# Altium project WT-32 V3.2.PrjPcb (part 3 of 4)

## Sheet Controller_Sheet.SchDoc: Controller
size 420 x 297 mm; Engineer: Zain Siddiqui; Revision: V3.2
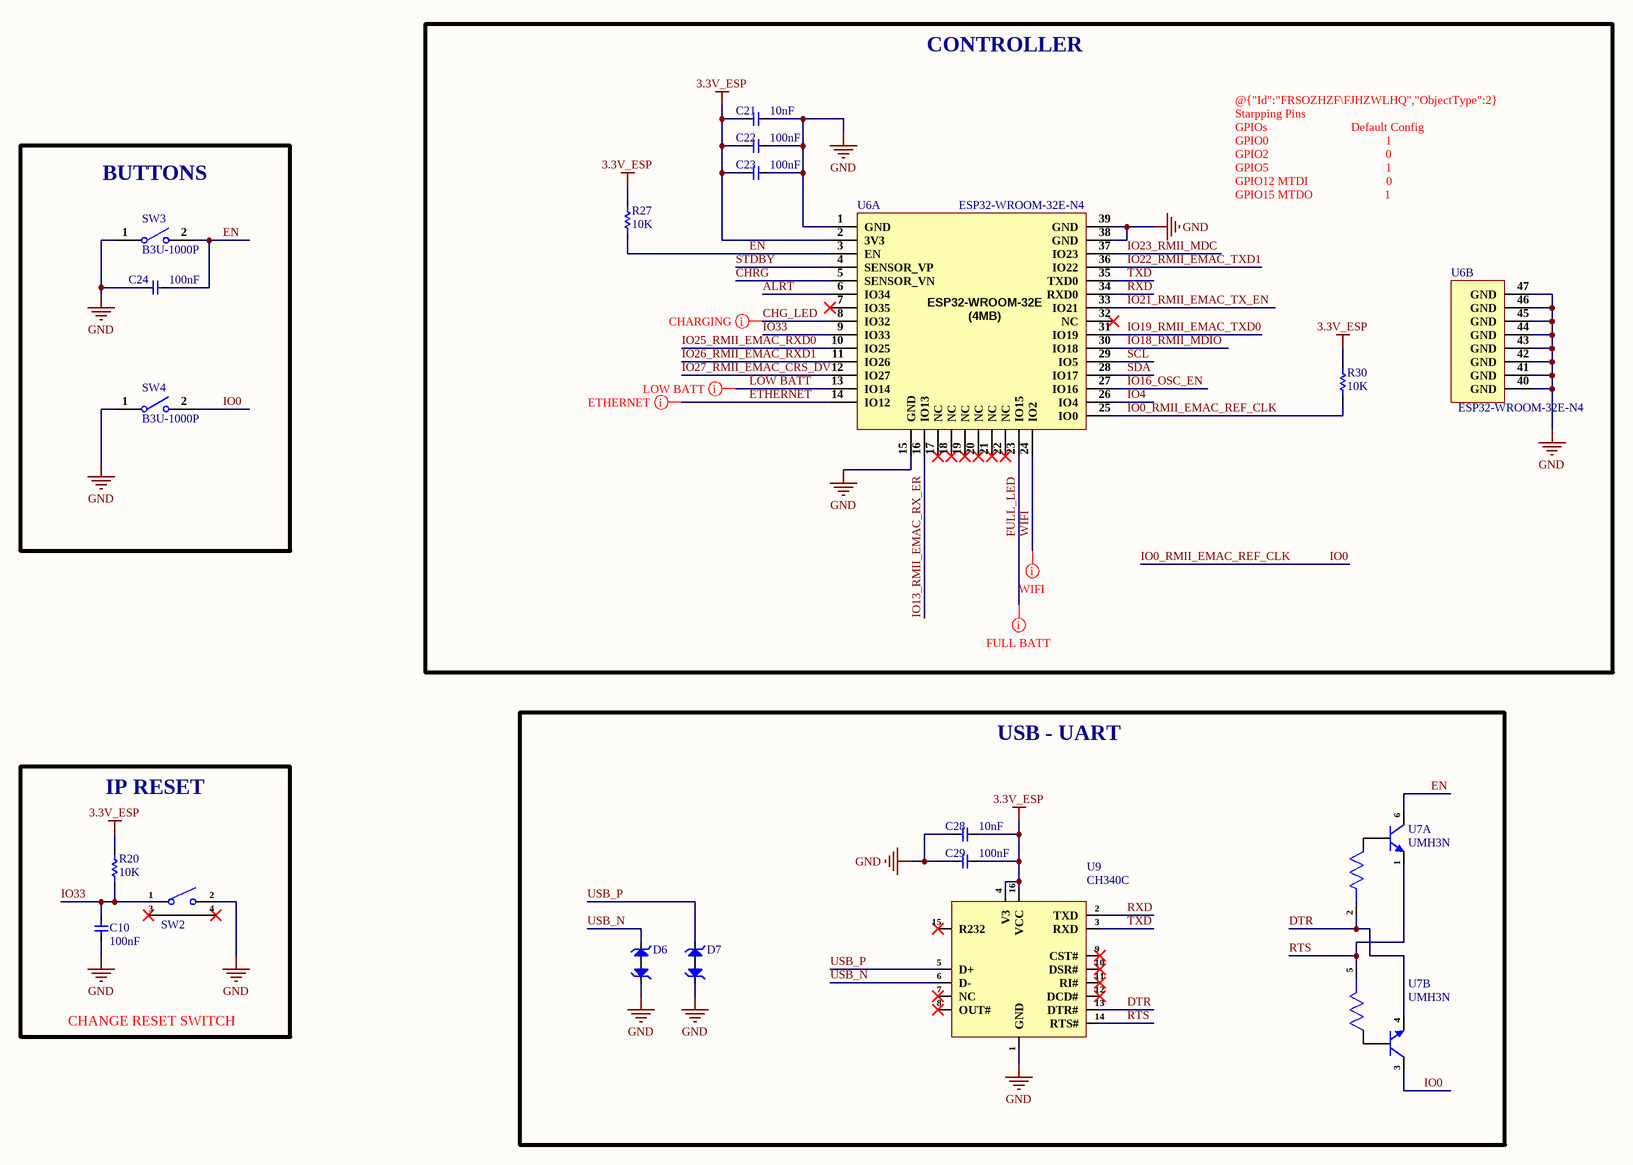
[diagram p1: Controller_Sheet.SchDoc]

### Parts
C10  100nF  [cap-0402]
C21  10nF  [Cap-0402]
C22  100nF  [cap-0402]
C23  100nF  [cap-0402]
C24  100nF  [cap-0402]
C28  10nF  [Cap-0402]
C29  100nF  [cap-0402]
D6  PESD5V0H1BSFYL  [DSN0603-2]  (value not drawn)
D7  PESD5V0H1BSFYL  [DSN0603-2]  (value not drawn)
R20  10K  [Res-0402]
R27  10K  [Res-0402]
R30  10K  [Res-0402]
SW2  1-1825027-4  [1-1825027-4]  (value not drawn)
SW3  B3U-1000P  [B3U-1000P]
SW4  B3U-1000P  [B3U-1000P]
U6  ESP32-WROOM-32E-N4  [38-SMD Module]  (parts A,B of 2)
U7  UMH3N  [SC-70-6_]  (parts A,B of 2)
U9  CH340C  [SOP-16]

### Blocks framed on the sheet
CONTROLLER: C21-C23 R27 R30 U6
BUTTONS: C24 SW3 SW4
USB - UART: C28 C29 D6 D7 U7 U9
IP RESET: C10 R20 SW2

### Nets
3.3V_ESP: C21.2 C22.2 C23.2 C28.1 C29.1 R20.2 R27.2 R30.2 U6.2(3V3) U9.4(V3) U9.16(VCC)
GND: C10.2 C21.1 C22.1 C23.1 C24.2 C28.2 C29.2 D6.1 D7.1 SW2.2 SW3.1 SW4.1 U6.1(GND) U6.15(GND) U6.38(GND) U6.39(GND) U6.40(GND) U6.41(GND) U6.42(GND) U6.43(GND) U6.44(GND) U6.45(GND) U6.46(GND) U6.47(GND) U9.1(GND)
ALRT: U6.6(IO34)
CHG_LED: U6.8(IO32)
CHRG: U6.5(SENSOR_VN)
DTR: U7.2 U7.4(E) U9.13(DTR#)
EN: C24.1 R27.1 SW3.2 U6.3(EN) U7.6(C)
ETHERNET: U6.14(IO12)
FULL_LED: U6.23(IO15)
IO0: R30.1 SW4.2 U6.25(IO0) U7.3(C)  [also labelled IO0_RMII_EMAC_REF_CLK]
IO4: U6.26(IO4)
IO13_RMII_EMAC_RX_ER: U6.16(IO13)
IO16_OSC_EN: U6.27(IO16)
IO18_RMII_MDIO: U6.30(IO18)
IO19_RMII_EMAC_TXD0: U6.31(IO19)
IO21_RMII_EMAC_TX_EN: U6.33(IO21)
IO22_RMII_EMAC_TXD1: U6.36(IO22)
IO23_RMII_MDC: U6.37(IO23)
IO25_RMII_EMAC_RXD0: U6.10(IO25)
IO26_RMII_EMAC_RXD1: U6.11(IO26)
IO27_RMII_EMAC_CRS_DV: U6.12(IO27)
IO33: C10.1 R20.1 SW2.1 U6.9(IO33)
LOW BATT: U6.13(IO14)
RTS: U7.1(E) U7.5 U9.14(RTS#)
RXD: U6.34(RXD0) U9.2(TXD)
SCL: U6.29(IO5)
SDA: U6.28(IO17)
STDBY: U6.4(SENSOR_VP)
TXD: U6.35(TXD0) U9.3(RXD)
USB_N: D6.2 U9.6(D-)
USB_P: D7.2 U9.5(D+)
WIFI: U6.24(IO2)

Not connected (* = marked no-connect by the designer): SW2 3* 4*; U6 7(IO35)* 17(NC)* 18(NC)* 19(NC)* 20(NC)* 21(NC)* 22(NC)* 32(NC)*; U9 7(NC)* 8(OUT#)* 9(CST#)* 10(DSR#)* 11(RI#)* 12(DCD#)* 15(R232)*

### Layout directives
mark named FULL BATT: FULL_LED
mark named LOW BATT: LOW BATT
mark named ETHERNET: ETHERNET
mark named WIFI: WIFI
mark named CHARGING: CHG_LED

### Notes on the sheet
- @{"Id":"FRSOZHZF\FJHZWLHQ","ObjectType":2} Starpping Pins
  GPIOs                            Default Config
  GPIO0                                       1
  GPIO2                                       0
  GPIO5                                       1
  GPIO12 MTDI                          0
  GPIO15 MTDO                        1
- CHANGE RESET SWITCH
- PROJECT
- TITLE
- DATE
- FILE NAME
- A3
- SIZE
- ENGINEER
- SHEET
- REV
- OF
- (in symbol ESP32-WROOM-32E-N4, part A) ESP32-WROOM-32E (4MB) /

### Library data of the parts
C10 C22-C24 C29 = C1005X7R1H104KT000F: CAP CER 0.1UF 50V X7R 0402; Manufacturer: TDK; Tolerance: 10%; Voltage: 25V; Item Type: Capacitor; Supplier 1: Avnet; Manufacturer Part Number: C1005X7R1H104KT000F; RoHS: No; Category: Ceramic Capacitors; Dielectric: X7R; Supplier Part Number 1: C1005X7R1H104KT000F; LCSC Part Number: C361198; ComponentLink1Description: LCSC; ComponentLink1URL: https://www.lcsc.com/product-detail/Multilayer-Ceramic-Capacitors-MLCC-SMD-SMT_TDK-C1005X7R1H104KT000F_C361198.html
C21 C28 = CC0402KRX7R8BB103: CAP CER 10000PF 25V X7R 0402; Manufacturer: Yageo; Tolerance: 10%; Item Type: Capacitor; Supplier 1: Digi-Key; Manufacturer Part Number: CC0402KRX7R8BB103; Stock 1: 0; Pricing 1: 1=0.1, 10=0.021, 100=0.0093, 500=0.00666, 1000=0.00523, 2500=0.00476, 5000=0.00438 (USD); Mount: Surface Mount; Case/Package: 0402; Case Code (Metric): 1005; Case Code (Imperial): 0402; Min Operating Temperature: -55°C; Max Operating Temperature: 125°C; Capacitance: 10nF; Dielectric: X7R; Voltage Rating: 25V; Package Quantity: 1; Packaging: Tape and Reel; Voltage Rating (DC): 25V; Termination: SMD/SMT; Composition: Ceramic; Length: 1mm; Height: 0.5mm; Depth: 0.5mm; Width: 0.02inch; Thickness: 0.022inch; Radiation Hardening: No; REACH SVHC: Unknown; Lead Free: Lead Free; Halogen Free: Halogen Free; ComponentLink1URL: http://www.yageo.com/documents/recent/UPY-GPHC_X7R_6.3V-to-50V_18.pdf?src-supplier=Digi-Key; ComponentLink1Description: http://www.yageo.com/documents/recent/UPY-GPHC_X7R_6.3V-to-50V_18.pdf?src-supplier=Digi-Key; ComponentLink2URL: https://www.verical.com/server-webapp/html/getDatasheet?partID=375418&src-supplier=Verical; ComponentLink2Description: https://www.verical.com/server-webapp/html/getDatasheet?partID=375418&src-supplier=Verical; ComponentLink3URL: http://www.yageo.com/documents/recent/UPY-GPHC_X7R_6.3V-to-50V_8.pdf?src-supplier=Avnet; ComponentLink3Description: http://www.yageo.com/documents/recent/UPY-GPHC_X7R_6.3V-to-50V_8.pdf?src-supplier=Avnet; ComponentLink4URL: https://4donline.ihs.com/images/VipMasterIC/IC/YAGO/YAGO-S-A0003557223/YAGO-S-A0003557223-1.pdf?hkey=52A5661711E402568146F3353EA87419&src-supplier=Element14; ComponentLink4Description: https://4donline.ihs.com/images/VipMasterIC/IC/YAGO/YAGO-S-A0003557223/YAGO-S-A0003557223-1.pdf?hkey=52A5661711E402568146F3353EA87419&src-supplier=Element14; ComponentLink5URL: http://www.farnell.com/datasheets/2167236.pdf?src-supplier=Element14; ComponentLink5Description: http://www.farnell.com/datasheets/2167236.pdf?src-supplier=Element14; ComponentLink6URL: http://www.mouser.com/ds/2/447/Yageo_UPY-GP_NP0_16V-to-50V_9-358835.pdf?src-supplier=Mouser; ComponentLink6Description: http://www.mouser.com/ds/2/447/Yageo_UPY-GP_NP0_16V-to-50V_9-358835.pdf?src-supplier=Mouser; Supplier Part Number 1: 311-1337-1-ND; LCSC Part Number: C327025
D6 D7 = PESD5V0H1BSFYL: TVS DIODE 5VWM 6.3VC DSN0603-2; Manufacturer: Nexperia; Supplier 1: Avnet; Manufacturer Part Number: PESD5V0H1BSFYL; RoHS: Yes; Category: ESD and Circuit Protection ICs; Stock 1: 9000; Pricing 1: 18000=0.06453, 36000=0.06278, 54000=0.06104, 90000=0.05930, 180000=0.05755, 900000=0.05581, 1800000=0.05406 (USD); RoHS Compliant: Yes; ComponentLink1URL: http://www.farnell.com/datasheets/1961312.pdf?src-supplier=Farnell; ComponentLink1Description: http://www.farnell.com/datasheets/1961312.pdf?src-supplier=Farnell; ComponentLink2URL: https://assets.nexperia.com/documents/data-sheet/PESD5V0H1BSF.pdf?src-supplier=Digi-Key; ComponentLink2Description: https://assets.nexperia.com/documents/data-sheet/PESD5V0H1BSF.pdf?src-supplier=Digi-Key; ComponentLink3URL: http://www.farnell.com/datasheets/1961312.pdf?src-supplier=Newark; ComponentLink3Description: http://www.farnell.com/datasheets/1961312.pdf?src-supplier=Newark; Supplier Part Number 1: PESD5V0H1BSFYL; LCSC Part Number: C477989; Item Type: Diode
R20 R27 R30 = RC0402FR-0710KL: RES 10K OHM 1% 1/16W 0402; Manufacturer: Yageo; Resistance: 10kR; Voltage Rating (DC): 50V; Temperature Coefficient: 100ppm/°C; Power Rating: 62.5mW; Max Power Dissipation: 63mW; Item Type: Resistor; Supplier 1: Mouser; Manufacturer Part Number: RC0402FR-0710KL; RoHS: Yes; Category: Chip SMD Resistors; Stock 1: 18648329; Pricing 1: 1=0.10000, 10=0.01400, 50=0.01400, 100=0.00500, 1000=0.00300, 10000=0.00200 (USD); Case/Package: 0402; Number of Pins: 2; Case Code (Imperial): 0402; Case Code (Metric): 1005; Min Operating Temperature: -55°C; Max Operating Temperature: 155°C; Resistor Type: Thick Film; Tolerance: 1%; Packaging: Tape and Reel; Voltage Rating: 50V; Termination: SMD/SMT; Working Voltage: 50V; Number of Terminations: 2; Features: Moisture Resistant; Series: RC; Resistance Tolerance: 1%; Construction: Rectangular; Length: 1mm; Width: 0.5mm; Height: 0.32mm; Depth: 0.5mm; Lead Pitch: 0.2mm; REACH SVHC: No SVHC; Lead Free: Lead Free; RoHS Compliant: Yes; Military Standard: Not; ComponentLink1URL: https://datasheet.ciiva.com/7660/38568-7660787.pdf?src-supplier=Element14; ComponentLink1Description: https://datasheet.ciiva.com/7660/38568-7660787.pdf?src-supplier=Element14; ComponentLink2URL: https://datasheet.ciiva.com/7849/1686128-7849814.pdf?src-supplier=Element14; ComponentLink2Description: https://datasheet.ciiva.com/7849/1686128-7849814.pdf?src-supplier=Element14; ComponentLink3URL: https://datasheet.ciiva.com/7983/1018594-7983486.pdf?src-supplier=Element14; ComponentLink3Description: https://datasheet.ciiva.com/7983/1018594-7983486.pdf?src-supplier=Element14; ComponentLink4URL: https://datasheet.ciiva.com/22747/1018594-22747512.pdf?src-supplier=Element14; ComponentLink4Description: https://datasheet.ciiva.com/22747/1018594-22747512.pdf?src-supplier=Element14; ComponentLink5URL: https://datasheet.ciiva.com/12667/pyu-rc0402-51-rohs-l-6-r-12667067.pdf?src-supplier=Mouser; ComponentLink5Description: https://datasheet.ciiva.com/12667/pyu-rc0402-51-rohs-l-6-r-12667067.pdf?src-supplier=Mouser; ComponentLink6URL: https://datasheet.ciiva.com/7849/1784430-7849813.pdf?src-supplier=Element14; ComponentLink6Description: https://datasheet.ciiva.com/7849/1784430-7849813.pdf?src-supplier=Element14; ComponentLink7URL: https://datasheet.ciiva.com/7849/1784430-7849815.pdf?src-supplier=Element14; ComponentLink7Description: https://datasheet.ciiva.com/7849/1784430-7849815.pdf?src-supplier=Element14; Supplier Part Number 1: 603-RC0402FR-0710KL; LCSC Part Number: C60490
SW2 = 1-1825027-4: With Bracket 50mA Round Button Right Angle SPST 100,000 Cycles 1.6N 24V Through Hole Tactile Switches ROHS; Manufacturer: TE Connectivity; Manufacturer Part Number: 1-1825027-4; LCSC Part Number: C2928195; Item Type: Tactile Switch; Package: Through Hole; ComponentLink1Description: LCSC Link; ComponentLink1URL: https://lcsc.com/product-detail/Tactile-Switches_TE-Connectivity-1-1825027-4_C2928195.html
SW3 SW4 = B3U-1000P: SWITCH TACTILE SPST-NO 0.05A 12V; Manufacturer: Omron; Mechanical Life: 200000Cycles; Operating Force: 1.5N; Throw Configuration: SPST; Current Rating: 50mA; Contact Resistance: 100mR; Illumination Type: Non-Illuminated,Illuminated; Switch Travel: 0.15mm; Switch Function: Off-Mom; Actuator Type: Standard; Actuator Length: 0.4mm; Ratings: Dust Proof,IP40; ComponentLink1URL: http://www.farnell.com/datasheets/60838.pdf?src-supplier=Farnell; ComponentLink1Description: http://www.farnell.com/datasheets/60838.pdf?src-supplier=Farnell; ComponentLink2URL: http://www.farnell.com/datasheets/60838.pdf?src-supplier=Element14; ComponentLink2Description: http://www.farnell.com/datasheets/60838.pdf?src-supplier=Element14; ComponentLink3URL: https://omronfs.omron.com/en_US/ecb/products/pdf/en-b3u.pdf?src-supplier=Digi-Key; ComponentLink3Description: https://omronfs.omron.com/en_US/ecb/products/pdf/en-b3u.pdf?src-supplier=Digi-Key; ComponentLink4URL: http://www.omron.com/ecb/products/pdf/en-b3u.pdf?src-supplier=Digi-Key; ComponentLink4Description: http://www.omron.com/ecb/products/pdf/en-b3u.pdf?src-supplier=Digi-Key; ComponentLink5URL: https://www.distrelec.biz/Web/Downloads/he/et/B3U_eng_datasheet.pdf?mime=application%2Fpdf&src-supplier=Distrelec; ComponentLink5Description: https://www.distrelec.biz/Web/Downloads/he/et/B3U_eng_datasheet.pdf?mime=application%2Fpdf&src-supplier=Distrelec; ComponentLink6URL: http://www.onlinecomponents.com/productFiles/mf-OM/en-b3u.pdf?src-supplier=Onlinecomponents.com; ComponentLink6Description: http://www.onlinecomponents.com/productFiles/mf-OM/en-b3u.pdf?src-supplier=Onlinecomponents.com; Supplier 1: Digi-Key; Manufacturer Part Number: B3U-1000P; Stock 1: 116454; Pricing 1: 1=1, 10=0.961, 25=0.9064, 50=0.7976, 100=0.7251, 250=0.68888, 500=0.67074, 1000=0.52571 (USD); Mount: Surface Mount; Weight: 0.000776oz; Contact Material: Silver; Min Operating Temperature: -25°C; Max Operating Temperature: 70°C; Packaging: Tape and Reel; Voltage Rating (DC): 12V; Package Quantity: 1; Max Current Rating: 50mA; Termination: SMD/SMT; Orientation: Straight; Max Voltage Rating (DC): 12V; Electrical Life: 200000Cycles; Insulation Resistance: 100MR; Contact Current Rating: 50mA; Length: 4mm; Height: 1.2mm; Depth: 2.5mm; Width: 3mm; REACH SVHC: Unknown; Lead Free: Lead Free; ComponentLink7URL: https://www.verical.com/server-webapp/html/getDatasheet?partID=552554&src-supplier=Verical; ComponentLink7Description: https://www.verical.com/server-webapp/html/getDatasheet?partID=552554&src-supplier=Verical; ComponentLink8URL: http://www.farnell.com/datasheets/1685550.pdf?src-supplier=Element14; ComponentLink8Description: http://www.farnell.com/datasheets/1685550.pdf?src-supplier=Element14; ComponentLink9URL: http://www.farnell.com/datasheets/2610940.pdf?src-supplier=Farnell; ComponentLink9Description: http://www.farnell.com/datasheets/2610940.pdf?src-supplier=Farnell; ComponentLink10URL: https://www.alliedelec.com/m/d/4c8a9ef82804fc3c241a13c1e298fd73.pdf?src-supplier=Allied+Electronics; ComponentLink10Description: https://www.alliedelec.com/m/d/4c8a9ef82804fc3c241a13c1e298fd73.pdf?src-supplier=Allied+Electronics; Supplier Part Number 1: SW1020DKR-ND; LCSC Part Number: C231329; Item Type: Switch
U6 = ESP32-WROOM-32E-N4: RX TXRX MOD WIFI TRACE ANT SMD; Manufacturer: Espressif Systems; Supplier 1: Digi-Key; Manufacturer Part Number: ESP32-WROOM-32E-N4; RoHS: No; Pricing 1: 1=3.00000 (USD); Supplier Part Number 1: 1965-ESP32-WROOM-32E(4MB)CT-ND; LCSC Part Number: C701341; ComponentLink1Description: LCSC Link; ComponentLink1URL: https://lcsc.com/product-detail/WiFi-Modules_ESPRESSIF-ESP32-WROOM-32E-N4_C701341.html
U7 = UMH3N: 2 NPN pre-biased (Dual) 150mW 100mA 50V SC-70-6(SOT-363) Digital Transistors ROHS; Manufacturer: Changjiang; Manufacturer Part Number: UMH3N; Footprint: SC-70-6(SOT-363); ComponentLink1Description: LCSC; ComponentLink1URL: https://www.lcsc.com/product-detail/Digital-Transistors_Jiangsu-Changjing-Electronics-Technology-Co-Ltd-UMH3N_C62892.html; LCSC Part Number: C62892; Item Type: Transistor
U9 = CH340C: 2Mbps Transceiver USB 2.0 SOP-16 USB ICs ROHS; Manufacturer: WCH; Item Type: IC; Manufacturer Part Number: CH340C; Package: SOP-16; LCSC Part Number: C84681; ComponentLink1Description: LCSC; ComponentLink1URL: https://www.lcsc.com/product-detail/USB-ICs_WCH-Jiangsu-Qin-Heng-CH340C_C84681.html

## Sheet Ethernet_Sheet.SchDoc: LAN8720
size 420 x 297 mm; Engineer: Zain Siddiqui; Revision: V3.2
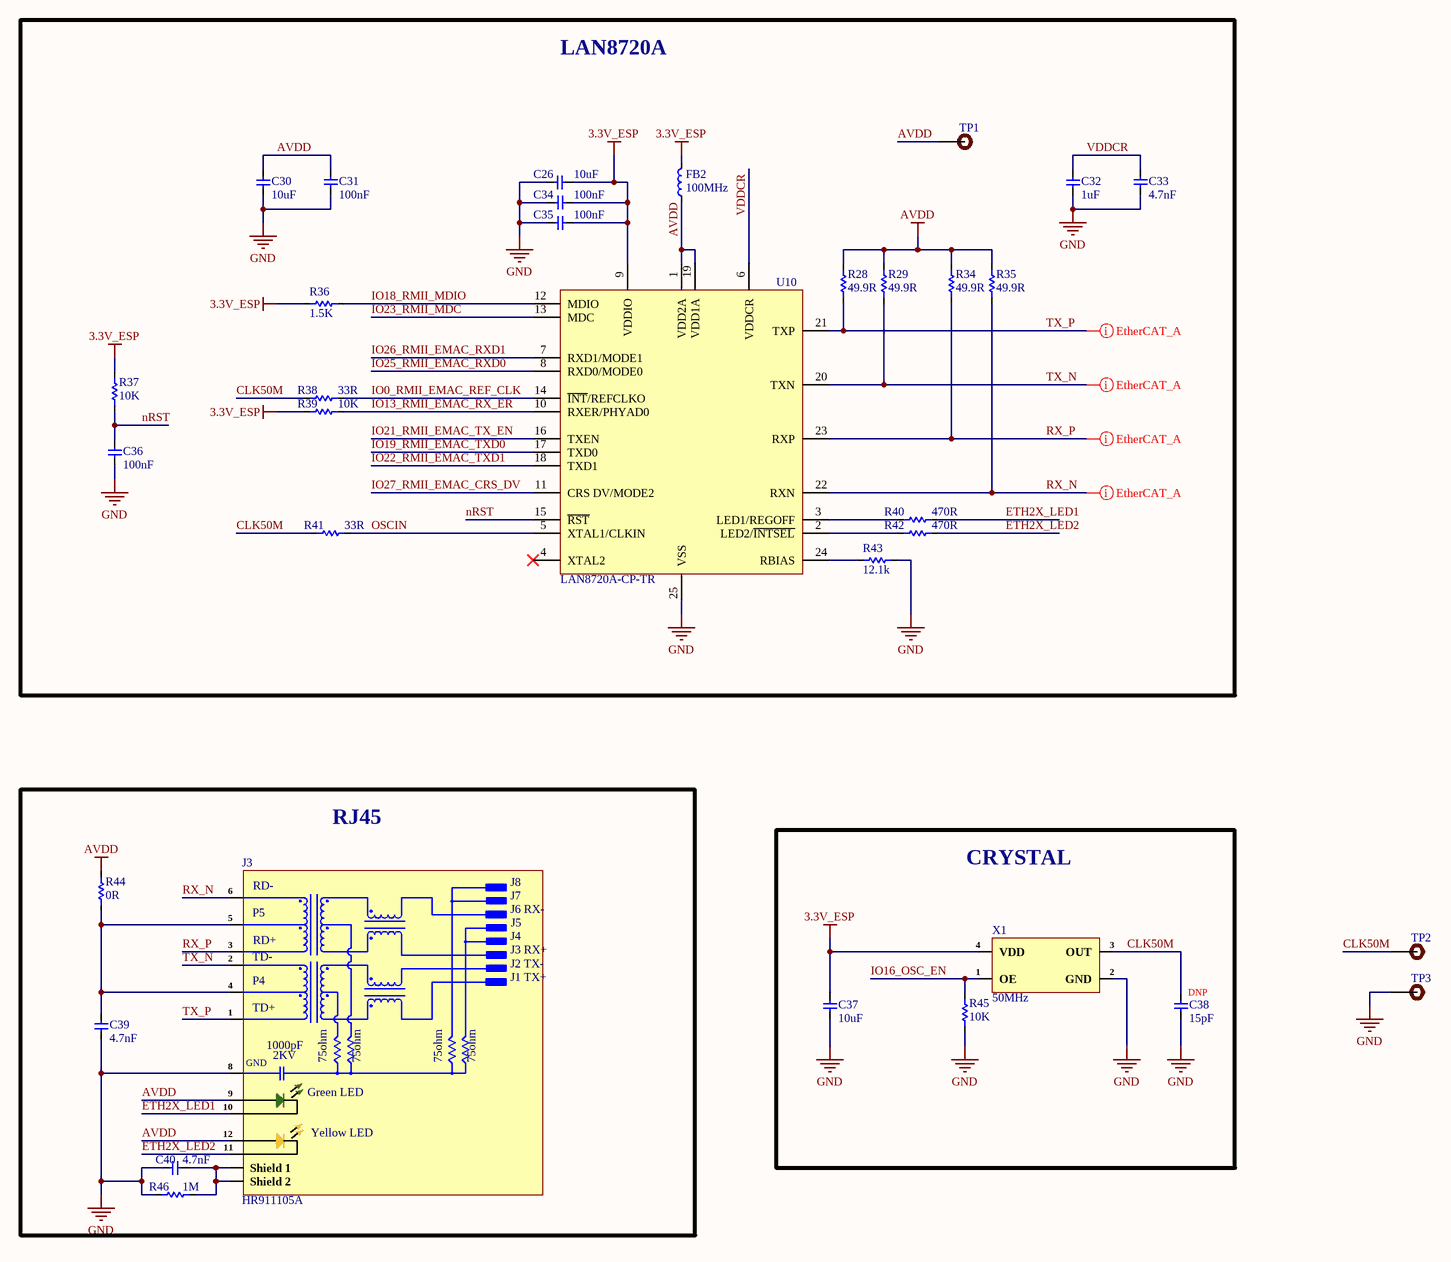
[diagram p2: Ethernet_Sheet.SchDoc]

### Parts
C26  10uF  [Cap-0603]
C30  10uF  [Cap-0603]
C31  100nF  [cap-0402]
C32  1uF  [Cap-0402]
C33  4.7nF  [Cap-0402]
C34  100nF  [cap-0402]
C35  100nF  [cap-0402]
C36  100nF  [cap-0402]
C37  10uF  [Cap-0603]
C38  15pF  [Cap-0603]  (no BOM)
C39  4.7nF  [Cap-0402]
C40  4.7nF  [Cap-1206]
FB2  100MHz  [IND-1206]
J3  HR911105A  [HR911105A]
R28  49.9R  [Res-0402]
R29  49.9R  [Res-0402]
R34  49.9R  [Res-0402]
R35  49.9R  [Res-0402]
R36  1.5K  [Res-0402]
R37  10K  [Res-0402]
R38  33R  [Res-0402]
R39  10K  [Res-0402]
R40  470R  [Res-0402]
R41  33R  [Res-0402]
R42  470R  [Res-0402]
R43  12.1k  [Res-0402]
R44  0R  [Res-0402]
R45  10K  [Res-0402]
R46  1M  [Res-1206]
TP1  TEST POINT 0.5mm Dia  [Test-point - 0.5mm]  (value not drawn)  (no BOM)
TP2  TEST POINT 0.5mm Dia  [Test-point - 0.5mm]  (value not drawn)  (no BOM)
TP3  TEST POINT 0.5mm Dia  [Test-point - 0.5mm]  (value not drawn)  (no BOM)
U10  LAN8720A-CP-TR  [LAN8720A-CP-TR]
X1  50MHz  [OT2EL4C4JI-111OLP-50M]

### Blocks framed on the sheet
LAN8720A: C26 C30-C36 FB2 R28 R29 R34-R43 TP1 U10
RJ45: C39 C40 J3 R44 R46
CRYSTAL: C37 C38 R45 X1

### Nets
3.3V_ESP: C26.2 C34.1 C35.1 C37.2 FB2.2 R36.2 R37.2 R39.2 U10.9(VDDIO) X1.4(VDD)
AVDD: C30.2 C31.1 FB2.1 J3.9(ANODE) J3.12(ANODE) R28.2 R29.2 R34.2 R35.2 R44.2 TP1.1 U10.1(VDD2A) U10.19(VDD1A)
GND: C26.1 C30.1 C31.2 C32.1 C33.2 C34.2 C35.2 C36.1 C37.1 C38.1 C39.1 C40.1 J3.8(GND) R43.1 R45.2 R46.1 TP3.1 U10.25(VSS) X1.2(GND)
CLK50M: C38.2 R38.1 R41.1 TP2.1 X1.3(OUT)
ETH2X_LED1: J3.10(CATHODE) R40.2
ETH2X_LED2: J3.11(CATHODE) R42.2
IO0_RMII_EMAC_REF_CLK: R38.2 U10.14(~{INT}/REFCLKO)  [project net IO0]
IO13_RMII_EMAC_RX_ER: R39.1 U10.10(RXER/PHYAD0)
IO16_OSC_EN: R45.1 X1.1(OE)
IO18_RMII_MDIO: R36.1 U10.12(MDIO)
IO19_RMII_EMAC_TXD0: U10.17(TXD0)
IO21_RMII_EMAC_TX_EN: U10.16(TXEN)
IO22_RMII_EMAC_TXD1: U10.18(TXD1)
IO23_RMII_MDC: U10.13(MDC)
IO25_RMII_EMAC_RXD0: U10.8(RXD0/MODE0)
IO26_RMII_EMAC_RXD1: U10.7(RXD1/MODE1)
IO27_RMII_EMAC_CRS_DV: U10.11(CRS_DV/MODE2)
nRST: C36.2 R37.1 U10.15(~{RST})
OSCIN: R41.2 U10.5(XTAL1/CLKIN)
RX_N: J3.6(RD-) R35.1 U10.22(RXN)
RX_P: J3.3(RD+) R34.1 U10.23(RXP)
TX_N: J3.2(TD-) R29.1 U10.20(TXN)
TX_P: J3.1(TD+) R28.1 U10.21(TXP)
VDDCR: C32.2 C33.1 U10.6(VDDCR)
NetC39_2: C39.2 J3.4(P4) J3.5(P5) R44.1
NetC40_2: C40.2 J3.Shield_1 J3.Shield_2 R46.2
NetR40_1: R40.1 U10.3(LED1/REGOFF)
NetR42_1: R42.1 U10.2(LED2/~{INTSEL})
NetR43_2: R43.2 U10.24(RBIAS)

Not connected (* = marked no-connect by the designer): U10 4(XTAL2)*

### Layout directives
differential pair; differential pair class Ethernet_Lines; net class Ethernet; rule Matched Net Lengths [Tolerance = 20mil]; rule Impedance Constraint [Min = 97.00    Max = 105.0    ]: RX_N, RX_P, TX_N, TX_P

### Notes on the sheet
- (near C38) DNP
- PROJECT
- TITLE
- DATE
- FILE NAME
- A3
- SIZE
- ENGINEER
- SHEET
- REV
- OF
- (in symbol HR911105A) J8; J7; J6 RX-; J5; J4; J3 RX+; J2 TX-; J1 TX+; 1000pF; 2KV; 75ohm; Green LED; Yellow LED

### Library data of the parts
C26 C30 C37 = CL10A106MA8NRNC: CAP CER 10UF 25V X5R 0603; Manufacturer: Samsung; Tolerance: 20%; Supplier 1: Avnet; Manufacturer Part Number: CL10A106MA8NRNC; RoHS: Yes; Category: Ceramic Capacitors; Pricing 1: 4000=0.03753, 8000=0.03700, 16000=0.03595, 24000=0.03515, 32000=0.03383, 40000=0.03304, 400000=0.03225 (USD); Mount: Surface Mount; Case/Package: 0603; Case Code (Metric): 1608; Case Code (Imperial): 0603; Contact Plating: Tin; Min Operating Temperature: -55°C; Max Operating Temperature: 85°C; Package Quantity: 1; Packaging: Tape and Reel; Capacitance: 10uF; Voltage Rating: 25V; Dielectric: X5R; Termination: Wraparound; Series: CL; Construction: Flat; Length: 0.063inch; Width: 0.031inch; Thickness: 0.035inch; Lead Free: Lead Free; RoHS Compliant: Yes; ComponentLink1URL: https://datasheet.ciiva.com/25766/cl10a106ma8nrnc-25766562.pdf?src-supplier=Digi-Key; ComponentLink1Description: https://datasheet.ciiva.com/25766/cl10a106ma8nrnc-25766562.pdf?src-supplier=Digi-Key; Supplier Part Number 1: CL10A106MA8NRNC; LCSC Part Number: C96446
C31 C34-C36 = C1005X7R1H104KT000F: as C10 on sheet Controller_Sheet; Supplier 1: Avnet; Manufacturer Part Number: C1005X7R1H104KT000F; RoHS: No; Category: Ceramic Capacitors; Dielectric: X7R; Supplier Part Number 1: C1005X7R1H104KT000F; LCSC Part Number: C361198; ComponentLink1Description: LCSC; ComponentLink1URL: https://www.lcsc.com/product-detail/Multilayer-Ceramic-Capacitors-MLCC-SMD-SMT_TDK-C1005X7R1H104KT000F_C361198.html
C32 = CC0402KRX5R7BB105: CAP CER 1UF 16V X5R 0402; Manufacturer: Yageo; Tolerance: 10%; Item Type: Capacitor; Supplier 1: Digi-Key; Manufacturer Part Number: CC0402KRX5R7BB105; Stock 1: 1405667; Pricing 1: 1=0.36, 10=0.252, 100=0.1512, 500=0.1134, 1000=0.09576, 2500=0.09072, 5000=0.08568 (USD); Mount: Surface Mount; Case/Package: 0402; Weight: 2.3E-05oz; Case Code (Imperial): 0402; Case Code (Metric): 1005; Min Operating Temperature: -55°C; Max Operating Temperature: 85°C; Capacitance: 1uF; Dielectric: X5R; Packaging: Tape and Reel; Voltage Rating (DC): 16V; Voltage Rating: 16V; Termination: SMD/SMT; Composition: Ceramic; Length: 1mm; Height: 0.5mm; Width: 0.02inch; Thickness: 0.022inch; Depth: 0.5mm; Radiation Hardening: No; Lead Free: Lead Free; Halogen Free: Halogen Free; ComponentLink1URL: http://www.yageo.com/documents/recent/UPY-GPHC_X5R_4V-to-50V_12.pdf?src-supplier=Avnet+Europe; ComponentLink1Description: http://www.yageo.com/documents/recent/UPY-GPHC_X5R_4V-to-50V_12.pdf?src-supplier=Avnet+Europe; Supplier Part Number 1: 311-1691-6-ND; LCSC Part Number: C325464
C33 C39 = CC0402KRX7R9BB472: CAP CER 4700PF 50V X7R 0402; Manufacturer: Yageo; Material: 4241ConductorMaterial; Tolerance: 10%; Temperature Coefficient: 30ppm/°C; Item Type: Capacitor; Supplier 1: Future Electronics; Manufacturer Part Number: CC0402KRX7R9BB472; RoHS: Yes; Category: Ceramic Capacitors; Stock 1: 1780000; Pricing 1: 10000=0.0021, 40000=0.002, 150000=0.0019, 400000=0.0018, 1000000=0.0017 (USD); Mount: Surface Mount; Case/Package: 0402; Number of Pins: 2NUMBER; Case Code (Imperial): 0402; Case Code (Metric): 1005; Min Operating Temperature: -55°C; Max Operating Temperature: 125°C; Capacitance: 4.7nF; Dielectric: X7R; Voltage Rating: 50V; Voltage Rating (DC): 50V; Packaging: Tape and Reel; Package Quantity: 1; Termination: SMD/SMT; Series: CC; Construction: Flat; Length: 1mm; Width: 0.02inch; Height: 0.5mm; Thickness: 0.022inch; Depth: 0.5mm; Radiation Hardening: No; Reach SVHC Compliant: No; RoHS Compliant: Yes; Halogen Free: 5694HalogenFree; Lead Free: 5697LeadFree; ComponentLink1URL: https://datasheet.ciiva.com/7978/1489800-7978108.pdf?src-supplier=Element14; ComponentLink1Description: https://datasheet.ciiva.com/7978/1489800-7978108.pdf?src-supplier=Element14; ComponentLink2URL: https://datasheet.ciiva.com/176/mlccorderingcode-176364.pdf?src-supplier=Digikey; ComponentLink2Description: https://datasheet.ciiva.com/176/mlccorderingcode-176364.pdf?src-supplier=Digikey; ComponentLink3URL: https://datasheet.ciiva.com/176/mlccorderingcode-176363.pdf?src-supplier=Digikey; ComponentLink3Description: https://datasheet.ciiva.com/176/mlccorderingcode-176363.pdf?src-supplier=Digikey; ComponentLink4URL: https://datasheet.ciiva.com/176/mlccorderingcode-176365.pdf?src-supplier=Digikey; ComponentLink4Description: https://datasheet.ciiva.com/176/mlccorderingcode-176365.pdf?src-supplier=Digikey; ComponentLink5URL: https://datasheet.ciiva.com/11586/upy-gphc-x7r-6-3v-to-50v-8-11586491.pdf?src-supplier=Avnet; ComponentLink5Description: https://datasheet.ciiva.com/11586/upy-gphc-x7r-6-3v-to-50v-8-11586491.pdf?src-supplier=Avnet; Supplier Part Number 1: 1989300; LCSC Part Number: C106208
C38 = CC0603JRNPO9BN150: CAP CER 15PF 50V C0G/NPO 0603; Manufacturer: Yageo; Dielectric Material: Ceramic; Tolerance: 5%; Dielectric: C0G; Insulation Resistance: 100GR; Item Type: Capacitor; Supplier 1: Future Electronics; Manufacturer Part Number: CC0603JRNPO9BN150; RoHS: Yes; Category: Ceramic Capacitors; Stock 1: 832000; Pricing 1: 4000=0.0038, 16000=0.0036, 80000=0.0034, 160000=0.0033, 500000=0.0031 (USD); Mounting Technology: Surface Mount; Case/Package: 0603; Pins: 2; Case Code (Metric): 1608; Case Code (Imperial): 0603; Min Operating Temperature: -55°C; Max Operating Temperature: 125°C; Value: 15pF; Series: CC; Packaging: Tape and Reel; Package Quantity: 1; Termination: SMD/SMT; Voltage Rating: 50V; Length: 1.6mm; Width: 0.031inch; Height: 0.8mm; Depth: 0.8mm; Thickness: 0.035inch; Radiation Hardening: No; RoHS Compliant: Yes; Reach SVHC Compliant: No; Lead Free: Lead Free; ComponentLink1URL: https://datasheet.ciiva.com/144/mlccorderingcode-144635.pdf?src-supplier=Digi-Key; ComponentLink1Description: https://datasheet.ciiva.com/144/mlccorderingcode-144635.pdf?src-supplier=Digi-Key; ComponentLink2URL: https://datasheet.ciiva.com/144/mlccorderingcode-144636.pdf?src-supplier=Digi-Key; ComponentLink2Description: https://datasheet.ciiva.com/144/mlccorderingcode-144636.pdf?src-supplier=Digi-Key; ComponentLink3URL: https://datasheet.ciiva.com/8033/1443161-8033721.pdf?src-supplier=Element14; ComponentLink3Description: https://datasheet.ciiva.com/8033/1443161-8033721.pdf?src-supplier=Element14; ComponentLink4URL: https://datasheet.ciiva.com/28450/1443161-28450472.pdf?src-supplier=Element14; ComponentLink4Description: https://datasheet.ciiva.com/28450/1443161-28450472.pdf?src-supplier=Element14; ComponentLink5URL: https://datasheet.ciiva.com/144/mlccorderingcode-144634.pdf?src-supplier=Digi-Key; ComponentLink5Description: https://datasheet.ciiva.com/144/mlccorderingcode-144634.pdf?src-supplier=Digi-Key; ComponentLink6URL: https://datasheet.ciiva.com/8033/1734582-8033723.pdf?src-supplier=Element14; ComponentLink6Description: https://datasheet.ciiva.com/8033/1734582-8033723.pdf?src-supplier=Element14; ComponentLink7URL: https://datasheet.ciiva.com/8033/1734582-8033722.pdf?src-supplier=Element14; ComponentLink7Description: https://datasheet.ciiva.com/8033/1734582-8033722.pdf?src-supplier=Element14; ComponentLink8URL: https://datasheet.ciiva.com/11464/upy-gp-np0-16v-to-50v-8-11464727.pdf?src-supplier=Avnet; ComponentLink8Description: https://datasheet.ciiva.com/11464/upy-gp-np0-16v-to-50v-8-11464727.pdf?src-supplier=Avnet; Supplier Part Number 1: 4234670; LCSC Part Number: C107037
C40 = CC1206KKX7RCBB472: CAP CER 4700PF 1KV X7R 1206; Manufacturer: Yageo; Dielectric Material: Ceramic; Tolerance: 10%; Item Type: Capacitor; Supplier 1: Future Electronics; Manufacturer Part Number: CC1206KKX7RCBB472; RoHS: Yes; Category: Ceramic Capacitors; Stock 1: 180000; Pricing 1: 3000=0.02860, 9000=0.02750, 15000=0.02700, 45000=0.02600, 75000=0.02510 (USD); Mount: Surface Mount; Case/Package: 1206; Number of Pins: 2; Case Code (Imperial): 1206; Case Code (Metric): 3216; Weight: 0.000571oz; Min Operating Temperature: -55°C; Max Operating Temperature: 125°C; Voltage Rating: 1kV; Capacitance: 4.7nF; Packaging: Tape and Reel; Voltage Rating (DC): 1kV; Dielectric: X7R; Termination: SMD/SMT; Resistor Type: Ceramic; Series: CC; Length: 3.2mm; Width: 0.063inch; Thickness: 0.057inch; Depth: 1.6mm; Radiation Hardening: No; Lead Free: Lead Free; RoHS Compliant: Yes; ComponentLink1URL: https://datasheet.ciiva.com/13208/upy-gp-np0-16v-to-50v-8-13208693.pdf?src-supplier=Mouser; ComponentLink1Description: https://datasheet.ciiva.com/13208/upy-gp-np0-16v-to-50v-8-13208693.pdf?src-supplier=Mouser; ComponentLink2URL: https://datasheet.ciiva.com/11466/hv-11466701.pdf?src-supplier=Avnet; ComponentLink2Description: https://datasheet.ciiva.com/11466/hv-11466701.pdf?src-supplier=Avnet; Supplier Part Number 1: 7130131; LCSC Part Number: C107198
FB2 = BLM31PG121SN1L: FERRITE BEAD 120 OHM 1206 1LN; Manufacturer: Murata; Material: Steel,Ferrite; Tolerance: 25%; Impedance: 120R; Max Current Rating: 3.5A; Number of Lines: 1; DC Resistance (DCR): 20mR; Max DC Current: 3A; Shielding: Unshielded; Supplier 1: Avnet; Manufacturer Part Number: BLM31PG121SN1L; RoHS: Yes; Category: Ferrite Beads and Chips; Stock 1: 290640; Pricing 1: 3000=0.11563, 6000=0.10938, 12000=0.10313, 18000=0.09688, 24000=0.09063, 30000=0.08438, 300000=0.07813 (USD); Case/Package: 1206; Number of Pins: 2; Core Material: Ferrite; Case Code (Metric): 3216; Case Code (Imperial): 1206; Contact Plating: Tin,Matte; Min Operating Temperature: -55°C; Max Operating Temperature: 125°C; Package Quantity: 3000; Packaging: Tape and Reel; Current Rating: 3.5A; Termination: SMD/SMT; Test Frequency: 100MHz; DC Current: 3A; Frequency: 100MHz; Length: 3.2mm; Width: 1.6mm; Height: 1.1mm; Depth: 1.6mm; Radiation Hardening: No; Military Standard: Not; Lead Free: Lead Free; RoHS Compliant: Yes; ComponentLink1URL: https://datasheet.ciiva.com/19460/1845419-19460234.pdf?src-supplier=Jameco; ComponentLink1Description: https://datasheet.ciiva.com/19460/1845419-19460234.pdf?src-supplier=Jameco; ComponentLink2URL: https://datasheet.ciiva.com/1012/l0132s0193blm31p-1012992.pdf?src-supplier=Digi-Key; ComponentLink2Description: https://datasheet.ciiva.com/1012/l0132s0193blm31p-1012992.pdf?src-supplier=Digi-Key; ComponentLink3URL: https://datasheet.ciiva.com/11799/0900766b811b5866-11799444.pdf?src-supplier=RSComponents; ComponentLink3Description: https://datasheet.ciiva.com/11799/0900766b811b5866-11799444.pdf?src-supplier=RSComponents; ComponentLink4URL: https://datasheet.ciiva.com/3081/l0110s0100blm31p-3081665.pdf?src-supplier=Avnet; ComponentLink4Description: https://datasheet.ciiva.com/3081/l0110s0100blm31p-3081665.pdf?src-supplier=Avnet; ComponentLink5URL: https://datasheet.ciiva.com/41449/001172383-da-01-en-drossel-1206-120r-3-2x1-60mm-3000st-41449554.pdf?src-supplier=Conrad; ComponentLink5Description: https://datasheet.ciiva.com/41449/001172383-da-01-en-drossel-1206-120r-3-2x1-60mm-3000st-41449554.pdf?src-supplier=Conrad; ComponentLink6URL: https://datasheet.ciiva.com/29348/442557-da-01-en-chip-drossel-1206-120r-3000ma-3-2x1-60mm-29348014.pdf?src-supplier=Conrad; ComponentLink6Description: https://datasheet.ciiva.com/29348/442557-da-01-en-chip-drossel-1206-120r-3000ma-3-2x1-60mm-29348014.pdf?src-supplier=Conrad; ComponentLink7URL: https://datasheet.ciiva.com/14122/apblm31p-data-e-14122856.pdf?src-supplier=Distrelec; ComponentLink7Description: https://datasheet.ciiva.com/14122/apblm31p-data-e-14122856.pdf?src-supplier=Distrelec; ComponentLink8URL: https://datasheet.ciiva.com/48436/blm31pg121sn1l-eng-tds-48436731.pdf?src-supplier=Distrelec; ComponentLink8Description: https://datasheet.ciiva.com/48436/blm31pg121sn1l-eng-tds-48436731.pdf?src-supplier=Distrelec; ComponentLink9URL: https://datasheet.ciiva.com/1012/l0110s0100blm31p-1012991.pdf?src-supplier=Digi-Key; ComponentLink9Description: https://datasheet.ciiva.com/1012/l0110s0100blm31p-1012991.pdf?src-supplier=Digi-Key; ComponentLink10URL: https://datasheet.ciiva.com/1012/l0110s0100blm31p-1012993.pdf?src-supplier=Digi-Key; ComponentLink10Description: https://datasheet.ciiva.com/1012/l0110s0100blm31p-1012993.pdf?src-supplier=Digi-Key; ComponentLink11URL: https://datasheet.ciiva.com/3081/l0110s0100blm31p-3081666.pdf?src-supplier=Avnet; ComponentLink11Description: https://datasheet.ciiva.com/3081/l0110s0100blm31p-3081666.pdf?src-supplier=Avnet; ComponentLink12URL: https://datasheet.ciiva.com/16390/l0110s0100blm31p-16390857.pdf?src-supplier=Future+Electronics; ComponentLink12Description: https://datasheet.ciiva.com/16390/l0110s0100blm31p-16390857.pdf?src-supplier=Future+Electronics; ComponentLink13URL: https://datasheet.ciiva.com/18093/getdatasheetpartid-152966-18093084.pdf?src-supplier=Verical; ComponentLink13Description: https://datasheet.ciiva.com/18093/getdatasheetpartid-152966-18093084.pdf?src-supplier=Verical; Supplier Part Number 1: BLM31PG121SN1L; LCSC Part Number: C85841; Item Type: Ferrite Bead
J3 = HR911105A: RJ45 RJReceptacle 1 WithLED Plugin Ethernet Connectors/Modular Connectors (RJ45 RJ11) ROHS; Manufacturer: HANRUN; Item Type: RJ45 Connector; Manufacturer Part Number: HR911105A; Package: Plugin; LCSC Part Number: C12074; ComponentLink1Description: LCSC; ComponentLink1URL: https://www.lcsc.com/product-detail/Ethernet-Connectors-Modular-Connectors-RJ45-RJ11_HANRUN-Zhongshan-HanRun-Elec-HR911105A_C12074.html
R28 R29 R34 R35 = RC0402FR-0749R9L: 49.9Ω 62.5mW 50V ±100ppm/℃ Thick Film Resistor ±1% 0402 Chip Resistor - Surface Mount ROHS; Manufacturer: YAGEO; Manufacturer Part Number: RC0402FR-0749R9L; LCSC Part Number: C87044; Item Type: Resistor; Package: 0402; ComponentLink1Description: LCSC Link; ComponentLink1URL: https://www.lcsc.com/product-detail/C87044.html
R36 = RC0402FR-071K5L: RES 1.5K OHM 1% 1/16W 0402; Manufacturer: Yageo; Resistance: 1.5kR; Power Rating: 62.5mW; Voltage Rating: 50V; Temperature Coefficient: 100ppm/°C; Max Power Dissipation: 63mW; Supplier 1: Digi-Key; Manufacturer Part Number: RC0402FR-071K5L; RoHS: Yes; Category: Chip SMD Resistors; Stock 1: 2832947; Pricing 1: 1=0.10000, 10=0.01500, 100=0.00610, 1000=0.00275, 2500=0.00239, 5000=0.00197 (USD); Case/Package: 0402; Case Code (Metric): 1005; Case Code (Imperial): 0402; Size Code: 0402; Min Operating Temperature: -55°C; Max Operating Temperature: 155°C; Resistor Type: Thick Film; Package Quantity: 1; Tolerance: 1%; Packaging: Tape and Reel; Number of Terminations: 2; Termination: SMD/SMT; Features: Moisture Resistant; Series: RC; Resistance Tolerance: 1%; Construction: Rectangular; Technology: THICK FILM; Length: 1mm; Width: 0.02inch; Height: 0.016inch; Depth: 0.5mm; RoHS Compliant: Yes; REACH SVHC: No SVHC; Military Standard: Not; Lead Free: Lead Free; ComponentLink1URL: https://datasheet.ciiva.com/11808/0900766b80c66297-11808238.pdf?src-supplier=RSComponents; ComponentLink1Description: https://datasheet.ciiva.com/11808/0900766b80c66297-11808238.pdf?src-supplier=RSComponents; ComponentLink2URL: https://datasheet.ciiva.com/46394/1018594-46394950.pdf?src-supplier=Element14; ComponentLink2Description: https://datasheet.ciiva.com/46394/1018594-46394950.pdf?src-supplier=Element14; ComponentLink3URL: https://datasheet.ciiva.com/2453/pyu-r-int-thick-7-2453440.pdf?src-supplier=Digi-Key; ComponentLink3Description: https://datasheet.ciiva.com/2453/pyu-r-int-thick-7-2453440.pdf?src-supplier=Digi-Key; ComponentLink4URL: https://datasheet.ciiva.com/2453/pyu-r-int-thick-7-2453441.pdf?src-supplier=Digi-Key; ComponentLink4Description: https://datasheet.ciiva.com/2453/pyu-r-int-thick-7-2453441.pdf?src-supplier=Digi-Key; ComponentLink5URL: https://datasheet.ciiva.com/2453/pyu-r-int-thick-7-2453439.pdf?src-supplier=Digi-Key; ComponentLink5Description: https://datasheet.ciiva.com/2453/pyu-r-int-thick-7-2453439.pdf?src-supplier=Digi-Key; ComponentLink6URL: https://datasheet.ciiva.com/12558/pyu-rc0402-51-rohs-l-6-r-8721-12558542.pdf?src-supplier=Mouser; ComponentLink6Description: https://datasheet.ciiva.com/12558/pyu-rc0402-51-rohs-l-6-r-8721-12558542.pdf?src-supplier=Mouser; ComponentLink7URL: https://datasheet.ciiva.com/7849/1018594-7849863.pdf?src-supplier=Element14; ComponentLink7Description: https://datasheet.ciiva.com/7849/1018594-7849863.pdf?src-supplier=Element14; ComponentLink8URL: https://datasheet.ciiva.com/7849/1018594-7849864.pdf?src-supplier=Element14; ComponentLink8Description: https://datasheet.ciiva.com/7849/1018594-7849864.pdf?src-supplier=Element14; ComponentLink9URL: https://datasheet.ciiva.com/15189/getdatasheetpartid-323992-15189370.pdf?src-supplier=Verical; ComponentLink9Description: https://datasheet.ciiva.com/15189/getdatasheetpartid-323992-15189370.pdf?src-supplier=Verical; Supplier Part Number 1: 311-1.50KLRCT-ND; LCSC Part Number: C114759
R37 R39 R45 = RC0402FR-0710KL: as R20 on sheet Controller_Sheet; Supplier 1: Mouser; Manufacturer Part Number: RC0402FR-0710KL; RoHS: Yes; Category: Chip SMD Resistors; Stock 1: 18648329; Pricing 1: 1=0.10000, 10=0.01400, 50=0.01400, 100=0.00500, 1000=0.00300, 10000=0.00200 (USD); Case/Package: 0402; Number of Pins: 2; Case Code (Imperial): 0402; Case Code (Metric): 1005; Min Operating Temperature: -55°C; Max Operating Temperature: 155°C; Resistor Type: Thick Film; Tolerance: 1%; Packaging: Tape and Reel; Voltage Rating: 50V; Termination: SMD/SMT; Working Voltage: 50V; Number of Terminations: 2; Features: Moisture Resistant; Series: RC; Resistance Tolerance: 1%; Construction: Rectangular; Length: 1mm; Width: 0.5mm; Height: 0.32mm; Depth: 0.5mm; Lead Pitch: 0.2mm; REACH SVHC: No SVHC; Lead Free: Lead Free; RoHS Compliant: Yes; Military Standard: Not; ComponentLink1URL: https://datasheet.ciiva.com/7660/38568-7660787.pdf?src-supplier=Element14; ComponentLink1Description: https://datasheet.ciiva.com/7660/38568-7660787.pdf?src-supplier=Element14; ComponentLink2URL: https://datasheet.ciiva.com/7849/1686128-7849814.pdf?src-supplier=Element14; ComponentLink2Description: https://datasheet.ciiva.com/7849/1686128-7849814.pdf?src-supplier=Element14; ComponentLink3URL: https://datasheet.ciiva.com/7983/1018594-7983486.pdf?src-supplier=Element14; ComponentLink3Description: https://datasheet.ciiva.com/7983/1018594-7983486.pdf?src-supplier=Element14; ComponentLink4URL: https://datasheet.ciiva.com/22747/1018594-22747512.pdf?src-supplier=Element14; ComponentLink4Description: https://datasheet.ciiva.com/22747/1018594-22747512.pdf?src-supplier=Element14; ComponentLink5URL: https://datasheet.ciiva.com/12667/pyu-rc0402-51-rohs-l-6-r-12667067.pdf?src-supplier=Mouser; ComponentLink5Description: https://datasheet.ciiva.com/12667/pyu-rc0402-51-rohs-l-6-r-12667067.pdf?src-supplier=Mouser; ComponentLink6URL: https://datasheet.ciiva.com/7849/1784430-7849813.pdf?src-supplier=Element14; ComponentLink6Description: https://datasheet.ciiva.com/7849/1784430-7849813.pdf?src-supplier=Element14; ComponentLink7URL: https://datasheet.ciiva.com/7849/1784430-7849815.pdf?src-supplier=Element14; ComponentLink7Description: https://datasheet.ciiva.com/7849/1784430-7849815.pdf?src-supplier=Element14; Supplier Part Number 1: 603-RC0402FR-0710KL; LCSC Part Number: C60490
R38 R41 = RC0402FR-0733RL: RES 33 OHM 1% 1/16W 0402; Manufacturer: Yageo; Power Rating: 62.5mW; Voltage Rating: 50V; Temperature Coefficient: 100ppm/°C; Max Power Dissipation: 63mW; Supplier 1: Mouser; Manufacturer Part Number: RC0402FR-0733RL; RoHS: Yes; Category: Chip SMD Resistors; Stock 1: 1843488; Pricing 1: 1=0.10000, 10=0.01200, 50=0.01200, 100=0.00500, 1000=0.00300, 10000=0.00100 (USD); Case/Package: 0402; Number of Pins: 2; Case Code (Imperial): 0402; Case Code (Metric): 1005; Size Code: 0402; Min Operating Temperature: -55°C; Max Operating Temperature: 155°C; Resistor Type: Thick Film; Resistance: 33R; Tolerance: 1%; Packaging: Tape and Reel; Voltage Rating (DC): 50V; Package Quantity: 10000; Termination: SMD/SMT; Features: Moisture Resistant; Series: RC; Number of Terminations: 2; Resistance Tolerance: 1%; Construction: Rectangular; Technology: THICK FILM; Length: 1mm; Width: 0.5mm; Height: 0.35mm; Depth: 0.5mm; RoHS Compliant: Yes; REACH SVHC: Unknown; Military Standard: Not; Lead Free: Lead Free; ComponentLink1URL: https://datasheet.ciiva.com/11819/0900766b80c66297-11819487.pdf?src-supplier=RSComponents; ComponentLink1Description: https://datasheet.ciiva.com/11819/0900766b80c66297-11819487.pdf?src-supplier=RSComponents; ComponentLink2URL: https://datasheet.ciiva.com/24070/pyu-rc0402-51-rohs-l-6-r-8721-24070077.pdf?src-supplier=Mouser; ComponentLink2Description: https://datasheet.ciiva.com/24070/pyu-rc0402-51-rohs-l-6-r-8721-24070077.pdf?src-supplier=Mouser; ComponentLink3URL: https://datasheet.ciiva.com/7849/1018594-7849967.pdf?src-supplier=Element14; ComponentLink3Description: https://datasheet.ciiva.com/7849/1018594-7849967.pdf?src-supplier=Element14; ComponentLink4URL: https://datasheet.ciiva.com/7849/1018594-7849966.pdf?src-supplier=Element14; ComponentLink4Description: https://datasheet.ciiva.com/7849/1018594-7849966.pdf?src-supplier=Element14; ComponentLink5URL: https://datasheet.ciiva.com/15189/getdatasheetpartid-329253-15189431.pdf?src-supplier=Verical; ComponentLink5Description: https://datasheet.ciiva.com/15189/getdatasheetpartid-329253-15189431.pdf?src-supplier=Verical; ComponentLink6URL: https://datasheet.ciiva.com/17070/pyu-rc0402-51-rohs-l-6-r-17070335.pdf?src-supplier=Future+Electronics; ComponentLink6Description: https://datasheet.ciiva.com/17070/pyu-rc0402-51-rohs-l-6-r-17070335.pdf?src-supplier=Future+Electronics; Supplier Part Number 1: 603-RC0402FR-0733RL; LCSC Part Number: C138002
R40 R42 = RC0402FR-07470RL: RES 470 OHM 1% 1/16W 0402; Manufacturer: Yageo; Item Type: Resistor; Voltage Rating: 50V; Power Rating: 62.5mW; Temperature Coefficient: 100ppm/°C; Max Power Dissipation: 63mW; Supplier: Avnet; Supplier Part Number: RC0402FR-07470RL; Manufacturer Part Number: RC0402FR-07470RL; RoHS: Yes; Stock: 10000; Pricing: 10000=0.00085 (USD); Case/Package: 0402; Case Code (Metric): 1005; Case Code (Imperial): 0402; Min Operating Temperature: -55°C; Max Operating Temperature: 155°C; Packaging: Tape and Reel; Value: 470R; Tolerance: 1%; Number of Terminations: 2; Working Voltage: 50V; Package Quantity: 1; Resistor Type: Thick Film; Termination: SMD/SMT; Features: Moisture Resistant; Series: RC; Resistance Tolerance: 1%; Construction: Rectangular; Voltage Rating (AC): 50V; Length: 1mm; Width: 0.02inch; Height: 0.016inch; Depth: 0.5mm; Lead Free: Lead Free; Reach SVHC Compliant: No; RoHS Compliant: Yes; Military Standard: Not; ComponentLink1URL: https://datasheet.ciiva.com/46412/1018594-46412838.pdf?src-supplier=Element14; ComponentLink1Description: https://datasheet.ciiva.com/46412/1018594-46412838.pdf?src-supplier=Element14; ComponentLink2URL: https://datasheet.ciiva.com/2453/pyu-r-int-thick-7-2453377.pdf?src-supplier=Digikey; ComponentLink2Description: https://datasheet.ciiva.com/2453/pyu-r-int-thick-7-2453377.pdf?src-supplier=Digikey; ComponentLink3URL: https://datasheet.ciiva.com/2453/pyu-r-int-thick-7-2453378.pdf?src-supplier=Digikey; ComponentLink3Description: https://datasheet.ciiva.com/2453/pyu-r-int-thick-7-2453378.pdf?src-supplier=Digikey; ComponentLink4URL: https://datasheet.ciiva.com/2453/pyu-r-int-thick-7-2453376.pdf?src-supplier=Digikey; ComponentLink4Description: https://datasheet.ciiva.com/2453/pyu-r-int-thick-7-2453376.pdf?src-supplier=Digikey; ComponentLink5URL: https://datasheet.ciiva.com/7850/1018594-7850015.pdf?src-supplier=Element14; ComponentLink5Description: https://datasheet.ciiva.com/7850/1018594-7850015.pdf?src-supplier=Element14; ComponentLink6URL: https://datasheet.ciiva.com/7850/1018594-7850014.pdf?src-supplier=Element14; ComponentLink6Description: https://datasheet.ciiva.com/7850/1018594-7850014.pdf?src-supplier=Element14; ComponentLink7URL: https://datasheet.ciiva.com/15189/getdatasheetpartid-330246-15189463.pdf?src-supplier=Verical; ComponentLink7Description: https://datasheet.ciiva.com/15189/getdatasheetpartid-330246-15189463.pdf?src-supplier=Verical; LCSC Part Number: C114877
R43 = RT0402BRD0712K1L: RES SMD 12.1KOHM 0.1% 1/16W 0402; Manufacturer: Yageo; Item Type: Resistor; Supplier: Future Electronics; Supplier Part Number: 2068365; Manufacturer Part Number: RT0402BRD0712K1L; RoHS: Yes; Category: Chip SMD Resistors; Stock: 60000; Pricing: 10000=0.0245, 20000=0.0217, 30000=0.0237, 50000=0.0233, 100000=0.0228, 200000=0.022 (USD); ComponentLink1URL: https://datasheet.ciiva.com/12812/pyu-rt-1-to-0-05-rohs-l-4-12812462.pdf?src-supplier=Mouser; ComponentLink1Description: https://datasheet.ciiva.com/12812/pyu-rt-1-to-0-05-rohs-l-4-12812462.pdf?src-supplier=Mouser; LCSC Part Number: C281773
R44 = RC0402FR-070RL: RES 0 OHM JUMPER 1/16W 0402; Manufacturer: Yageo; Item Type: Resistors; Tolerance: 1%; Power Rating: 62.5mW; Voltage Rating: 50V; Temperature Coefficient: 200ppm/°C; Max Power Dissipation: 63mW; Supplier 1: Mouser; Manufacturer Part Number: RC0402FR-070RL; RoHS: Yes; Stock 1: 8556842; Pricing 1: 1=0.10000, 10=0.01400, 50=0.01400, 100=0.00600, 1000=0.00300, 5000=0.00200, 10000=0.00100 (USD); Mount: Surface Mount; Case/Package: 0402; Contact Plating: Tin,Matte; Case Code (Imperial): 0402; Case Code (Metric): 1005; Size Code: 0402; Min Operating Temperature: -55°C; Max Operating Temperature: 155°C; Resistance: 0R; Resistor Type: Thick Film; Packaging: Tape and Reel; Termination: SMD/SMT; Features: Moisture Resistant; Series: RC; Number of Terminations: 2; Length: 1mm; Width: 0.5mm; Height: 0.35mm; Radiation Hardening: No; Lead Free: Lead Free; RoHS Compliant: Yes; ComponentLink1URL: https://datasheet.ciiva.com/8896/pyu-rc0402-51-rohs-l-6-8896149.pdf?src-supplier=Avnet; ComponentLink1Description: https://datasheet.ciiva.com/8896/pyu-rc0402-51-rohs-l-6-8896149.pdf?src-supplier=Avnet; ComponentLink2URL: https://datasheet.ciiva.com/16790/pyu-rc0402-51-rohs-l-6-r-16790444.pdf?src-supplier=Future+Electronics; ComponentLink2Description: https://datasheet.ciiva.com/16790/pyu-rc0402-51-rohs-l-6-r-16790444.pdf?src-supplier=Future+Electronics; Supplier Part Number 1: 603-RC0402FR-070RL; LCSC Part Number: C106231
R46 = RC1206FR-071ML: RES 1M OHM 1% 1/4W 1206; Manufacturer: Yageo; Resistance: 1MR; Temperature Coefficient: 100ppm/°C; Power Rating: 250mW; Voltage Rating: 200V; Item Type: Resistor; Supplier 1: Avnet; Manufacturer Part Number: RC1206FR-071ML; RoHS: Yes; Category: Chip SMD Resistors; Stock 1: 935000; Pricing 1: 5000=0.00412, 10000=0.00406, 20000=0.00394 (USD); Case/Package: 1206; Case Code (Imperial): 1206; Case Code (Metric): 3216; Size Code: 1206; Min Operating Temperature: -55°C; Max Operating Temperature: 155°C; Tolerance: 1%; Packaging: Tape and Reel; Resistor Type: Thick Film; Package Quantity: 5000; Termination: SMD/SMT; Features: Moisture Resistant; Series: RC; Max Power Dissipation: 250mW; Number of Terminations: 2; Technology: THICK FILM; Resistance Tolerance: 1%; Construction: Rectangular; Length: 3.1mm; Width: 1.6mm; Height: 0.55mm; Depth: 1.6mm; Lead Free: Lead Free; Military Standard: Not; RoHS Compliant: Yes; ComponentLink1URL: https://datasheet.ciiva.com/11819/0900766b80c6630a-11819912.pdf?src-supplier=RSComponents; ComponentLink1Description: https://datasheet.ciiva.com/11819/0900766b80c6630a-11819912.pdf?src-supplier=RSComponents; ComponentLink2URL: https://datasheet.ciiva.com/46445/444357-46445709.pdf?src-supplier=Element14; ComponentLink2Description: https://datasheet.ciiva.com/46445/444357-46445709.pdf?src-supplier=Element14; ComponentLink3URL: https://datasheet.ciiva.com/7857/444357-7857289.pdf?src-supplier=Element14; ComponentLink3Description: https://datasheet.ciiva.com/7857/444357-7857289.pdf?src-supplier=Element14; ComponentLink4URL: https://datasheet.ciiva.com/7857/444357-7857288.pdf?src-supplier=Element14; ComponentLink4Description: https://datasheet.ciiva.com/7857/444357-7857288.pdf?src-supplier=Element14; ComponentLink5URL: https://datasheet.ciiva.com/17033/pyu-rc1206-51-rohs-l-4-17033611.pdf?src-supplier=Future+Electronics; ComponentLink5Description: https://datasheet.ciiva.com/17033/pyu-rc1206-51-rohs-l-4-17033611.pdf?src-supplier=Future+Electronics; Supplier Part Number 1: RC1206FR-071ML; LCSC Part Number: C108083
TP1-TP3 = TEST POINT 0.5mm Dia: Test Point ON; Item Type: Test Point; Manufacturer Part Number: TEST POINT 0.5mm Dia
U10 = LAN8720A-CP-TR: IC TRANSCEIVER FULL 2/2 24SQFN; Manufacturer: MICROCHIP; Simplex/Duplex: Full Duplex; Item Type: RMII; Max Operating Temperature: 85°C; Packaging: Tape and Reel; Min Operating Temperature: 0°C; Mount: Surface Mount; Manufacturer Part Number: LAN8720A-CP-TR; LCSC Part Number: C45223; Package: QFN-24-EP(4x4); ComponentLink1Description: LCSC Link; ComponentLink1URL: https://www.lcsc.com/product-detail/C45223.html?s_z=n_LAN8720A
X1 = OT2EL4C4JI-111OLP-50M: 1.8V~3.3V ±10ppm ±20ppm CMOS 50MHz SMD3225-4P Crystal Oscillators ROHS; Manufacturer: YXC Crystal Oscillators; Manufacturer Part Number: OT2EL4C4JI-111OLP-50M; LCSC Part Number: C5203552; Item Type: Crystal; Package: SMD3225-4P; ComponentLink1Description: LCSC Link; ComponentLink1URL: https://lcsc.com/product-detail/Crystal-Oscillators_YXC-Crystal-Oscillators-OT2EL4C4JI-111OLP-50M_C5203552.html

## Sheet FuelGauge_Sheet.SchDoc: Fuel Gauge
size 420 x 297 mm; Engineer: Zain Siddiqui; Revision: V3.2
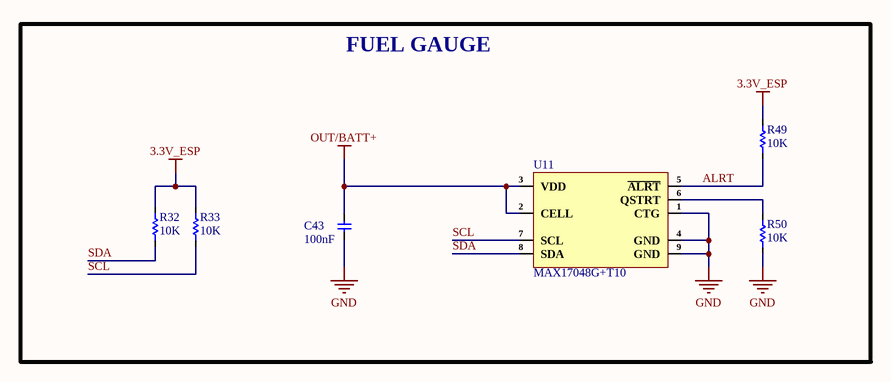
[diagram p3: FuelGauge_Sheet.SchDoc]

### Parts
C43  100nF  [cap-0402]
R32  10K  [Res-0402]
R33  10K  [Res-0402]
R49  10K  [Res-0402]
R50  10K  [Res-0402]
U11  MAX17048G+T10  [8-TDFN-EP (2x2)]

### Blocks framed on the sheet
FUEL GAUGE: C43 R32 R33 R49 R50 U11

### Nets
3.3V_ESP: R32.2 R33.2 R49.2
GND: C43.2 R50.1 U11.1(CTG) U11.4(GND) U11.9(GND)
OUT/BATT+: C43.1 U11.2(CELL) U11.3(VDD)
ALRT: R49.1 U11.5(~{ALRT})
SCL: R33.1 U11.7(SCL)
SDA: R32.1 U11.8(SDA)
NetR50_2: R50.2 U11.6(QSTRT)

### Notes on the sheet
- PROJECT
- TITLE
- DATE
- FILE NAME
- A3
- SIZE
- ENGINEER
- SHEET
- REV
- OF

### Library data of the parts
C43 = C1005X7R1H104KT000F: as C10 on sheet Controller_Sheet; Supplier 1: Avnet; Manufacturer Part Number: C1005X7R1H104KT000F; RoHS: No; Category: Ceramic Capacitors; Dielectric: X7R; Supplier Part Number 1: C1005X7R1H104KT000F; LCSC Part Number: C361198; ComponentLink1Description: LCSC; ComponentLink1URL: https://www.lcsc.com/product-detail/Multilayer-Ceramic-Capacitors-MLCC-SMD-SMT_TDK-C1005X7R1H104KT000F_C361198.html
R32 R33 R49 R50 = RC0402FR-0710KL: as R20 on sheet Controller_Sheet; Supplier 1: Mouser; Manufacturer Part Number: RC0402FR-0710KL; RoHS: Yes; Category: Chip SMD Resistors; Stock 1: 18648329; Pricing 1: 1=0.10000, 10=0.01400, 50=0.01400, 100=0.00500, 1000=0.00300, 10000=0.00200 (USD); Case/Package: 0402; Number of Pins: 2; Case Code (Imperial): 0402; Case Code (Metric): 1005; Min Operating Temperature: -55°C; Max Operating Temperature: 155°C; Resistor Type: Thick Film; Tolerance: 1%; Packaging: Tape and Reel; Voltage Rating: 50V; Termination: SMD/SMT; Working Voltage: 50V; Number of Terminations: 2; Features: Moisture Resistant; Series: RC; Resistance Tolerance: 1%; Construction: Rectangular; Length: 1mm; Width: 0.5mm; Height: 0.32mm; Depth: 0.5mm; Lead Pitch: 0.2mm; REACH SVHC: No SVHC; Lead Free: Lead Free; RoHS Compliant: Yes; Military Standard: Not; ComponentLink1URL: https://datasheet.ciiva.com/7660/38568-7660787.pdf?src-supplier=Element14; ComponentLink1Description: https://datasheet.ciiva.com/7660/38568-7660787.pdf?src-supplier=Element14; ComponentLink2URL: https://datasheet.ciiva.com/7849/1686128-7849814.pdf?src-supplier=Element14; ComponentLink2Description: https://datasheet.ciiva.com/7849/1686128-7849814.pdf?src-supplier=Element14; ComponentLink3URL: https://datasheet.ciiva.com/7983/1018594-7983486.pdf?src-supplier=Element14; ComponentLink3Description: https://datasheet.ciiva.com/7983/1018594-7983486.pdf?src-supplier=Element14; ComponentLink4URL: https://datasheet.ciiva.com/22747/1018594-22747512.pdf?src-supplier=Element14; ComponentLink4Description: https://datasheet.ciiva.com/22747/1018594-22747512.pdf?src-supplier=Element14; ComponentLink5URL: https://datasheet.ciiva.com/12667/pyu-rc0402-51-rohs-l-6-r-12667067.pdf?src-supplier=Mouser; ComponentLink5Description: https://datasheet.ciiva.com/12667/pyu-rc0402-51-rohs-l-6-r-12667067.pdf?src-supplier=Mouser; ComponentLink6URL: https://datasheet.ciiva.com/7849/1784430-7849813.pdf?src-supplier=Element14; ComponentLink6Description: https://datasheet.ciiva.com/7849/1784430-7849813.pdf?src-supplier=Element14; ComponentLink7URL: https://datasheet.ciiva.com/7849/1784430-7849815.pdf?src-supplier=Element14; ComponentLink7Description: https://datasheet.ciiva.com/7849/1784430-7849815.pdf?src-supplier=Element14; Supplier Part Number 1: 603-RC0402FR-0710KL; LCSC Part Number: C60490
U11 = MAX17048G+T10: IC BATT MON LI-ION 1CELL 8TDFN; Manufacturer: Maxim; Output Voltage: 400mV; Operating Supply Current: 23uA; Operating Supply Voltage: 4.5V; Supplier 1: Mouser; Manufacturer Part Number: MAX17048G+T10; RoHS: Yes; Category: Battery Management; Stock 1: 41293; Pricing 1: 1=3.34000, 10=3.00000, 50=2.84000, 100=2.46000, 1000=1.89000, 10000=1.83000 (USD); Mount: Surface Mount; Number of Pins: 8; Contact Plating: Tin,Matte; Min Operating Temperature: -20°C; Max Operating Temperature: 85°C; Packaging: Tape and Reel; Package Quantity: 10000; Series: ModelGauge™; Radiation Hardening: No; RoHS Compliant: Yes; ComponentLink1URL: https://datasheet.ciiva.com/14083/max17048-max17049-14083973.pdf?src-supplier=Digi-Key; ComponentLink1Description: https://datasheet.ciiva.com/14083/max17048-max17049-14083973.pdf?src-supplier=Digi-Key; Supplier Part Number 1: 700-MAX17048G+T10; LCSC Part Number: C2682616; Item Type: IC